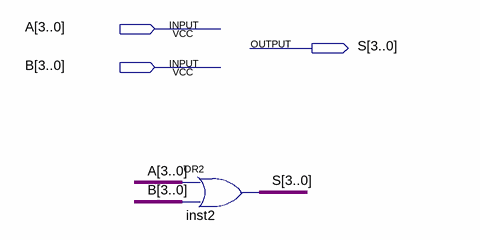
[diagram p0: schematic sheet]
// Quartus schematic OP_OR.bdf as structural Verilog: 1 symbols, 3 pins
module OP_OR (
  input  [3:0] A,
  input  [3:0] B,
  output [3:0] S
);

  assign S = A | B;  // OR2 inst2, 4 bits wide
endmodule
